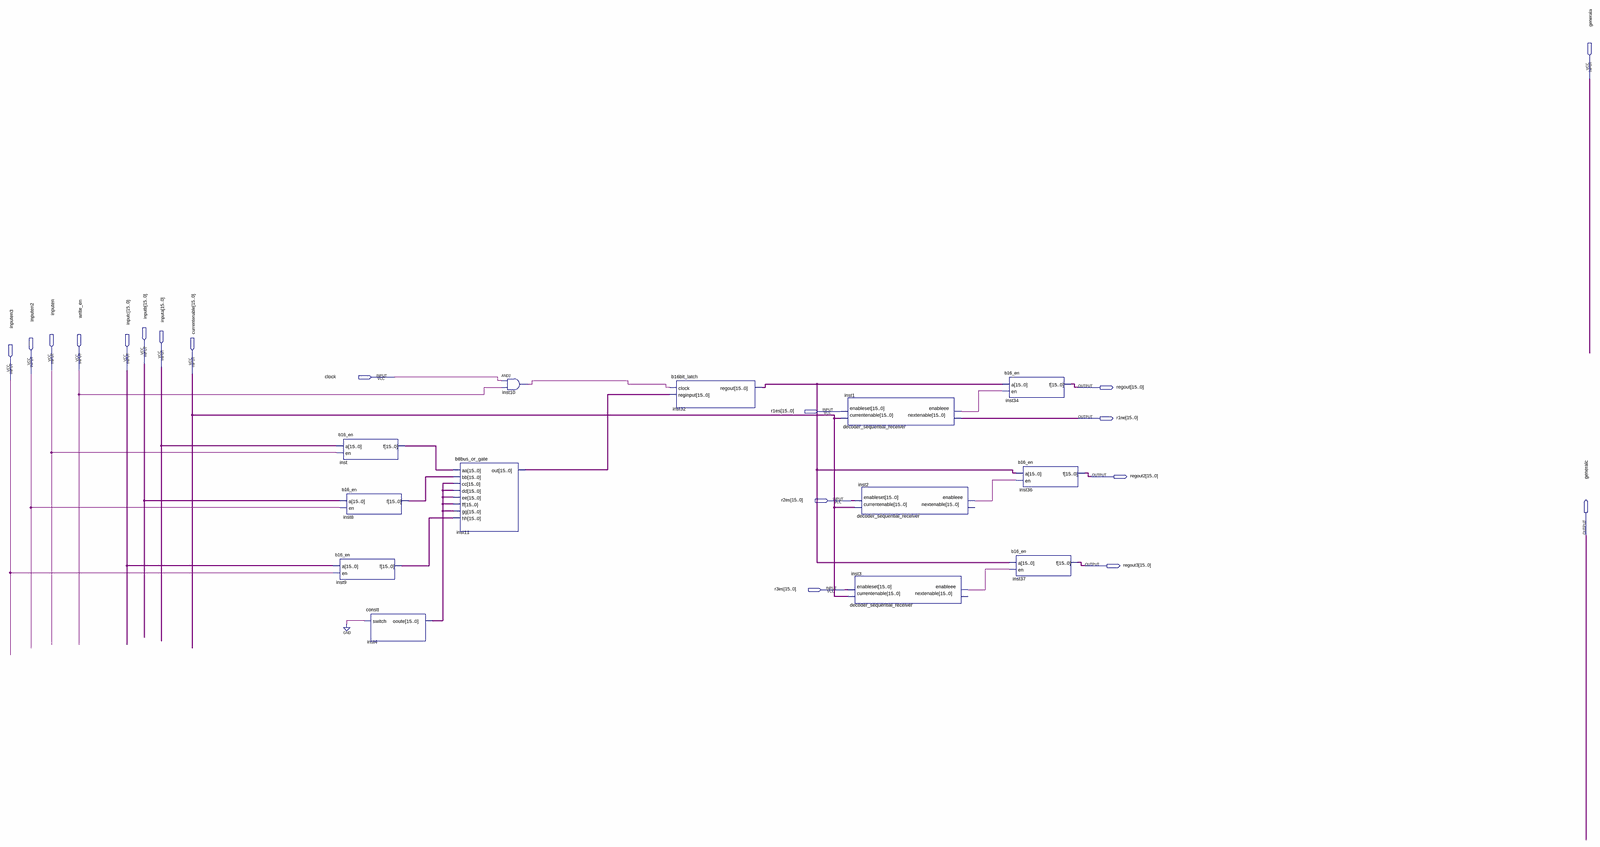
[diagram p0: schematic sheet, whole]
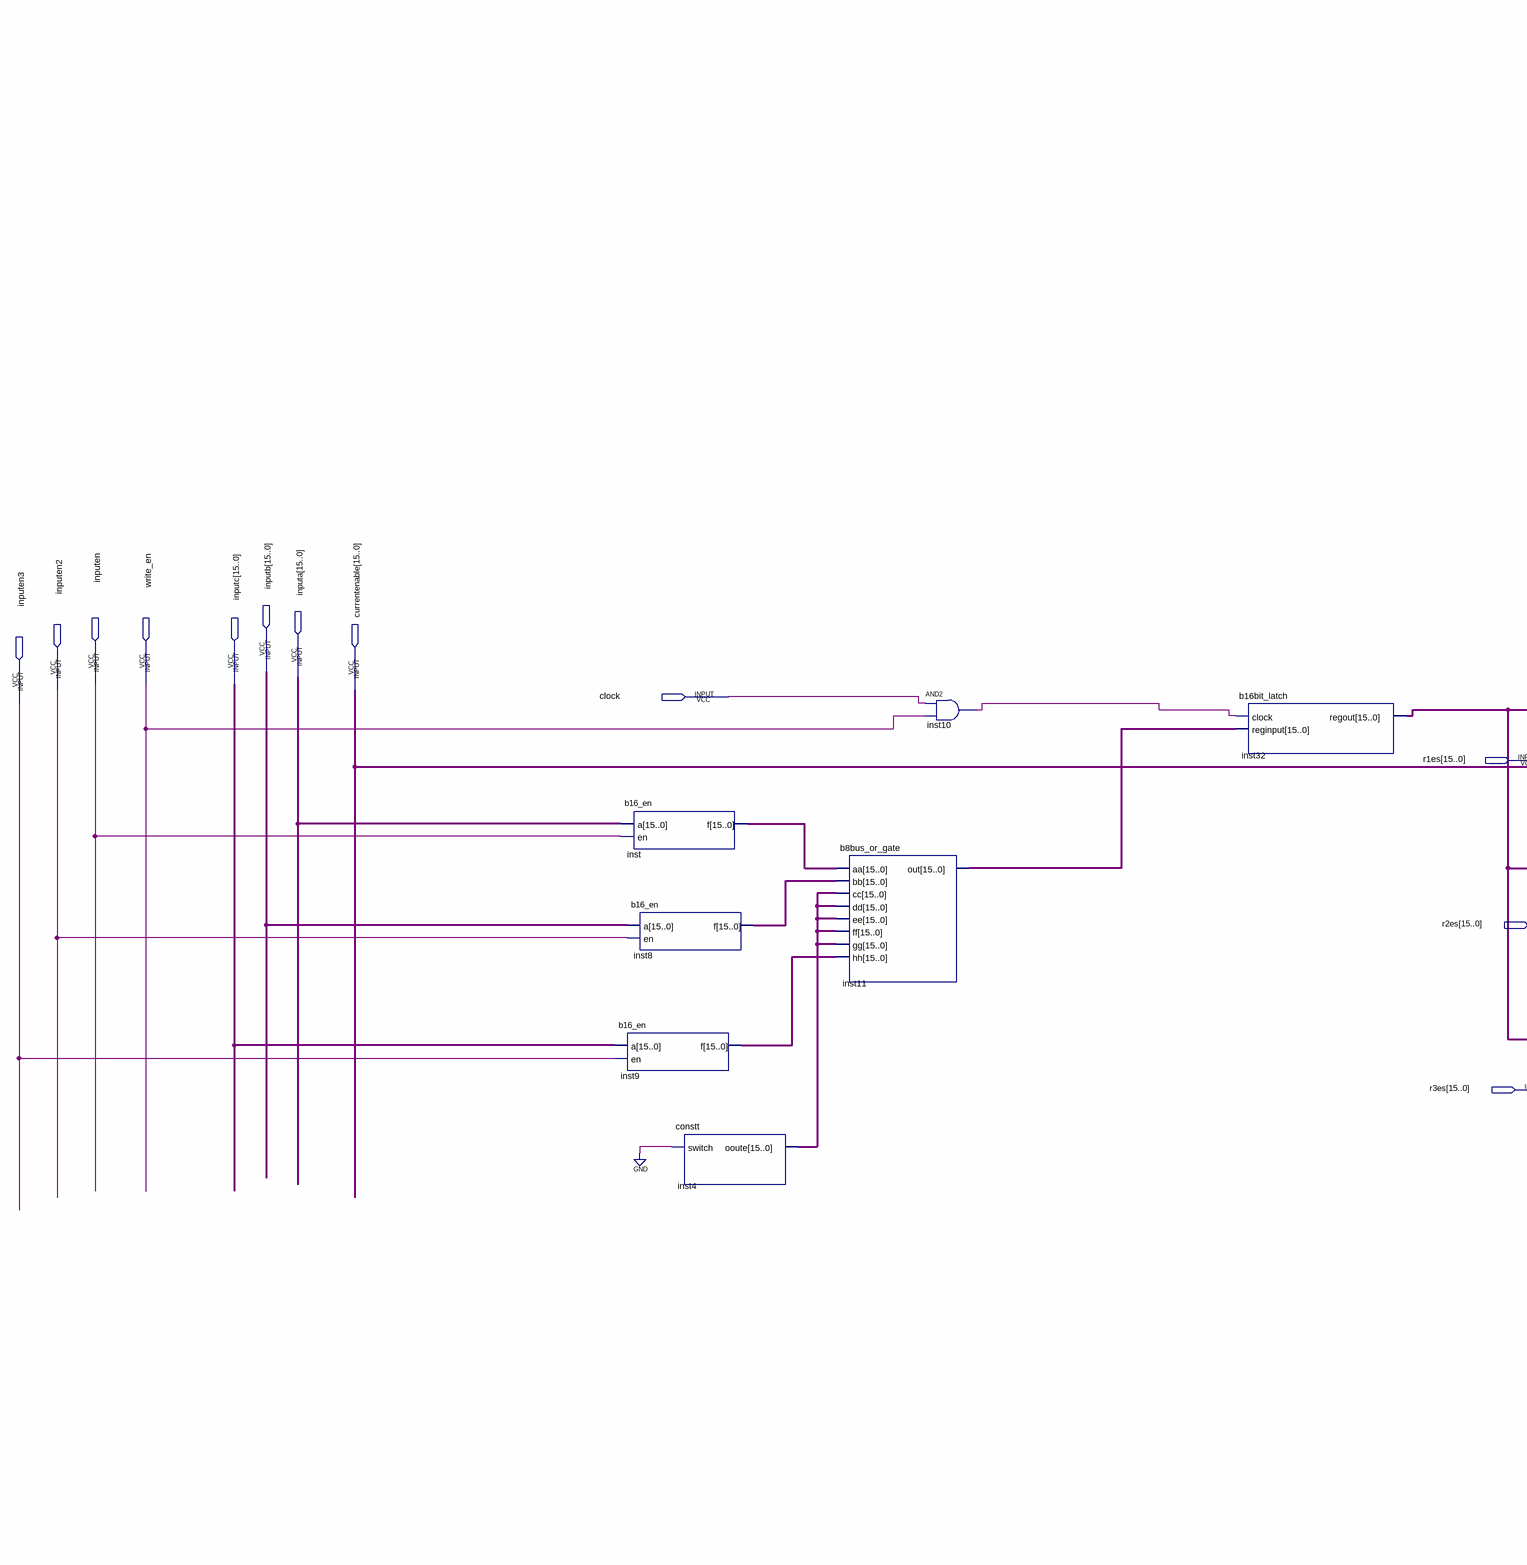
[diagram p1: schematic sheet, left part]
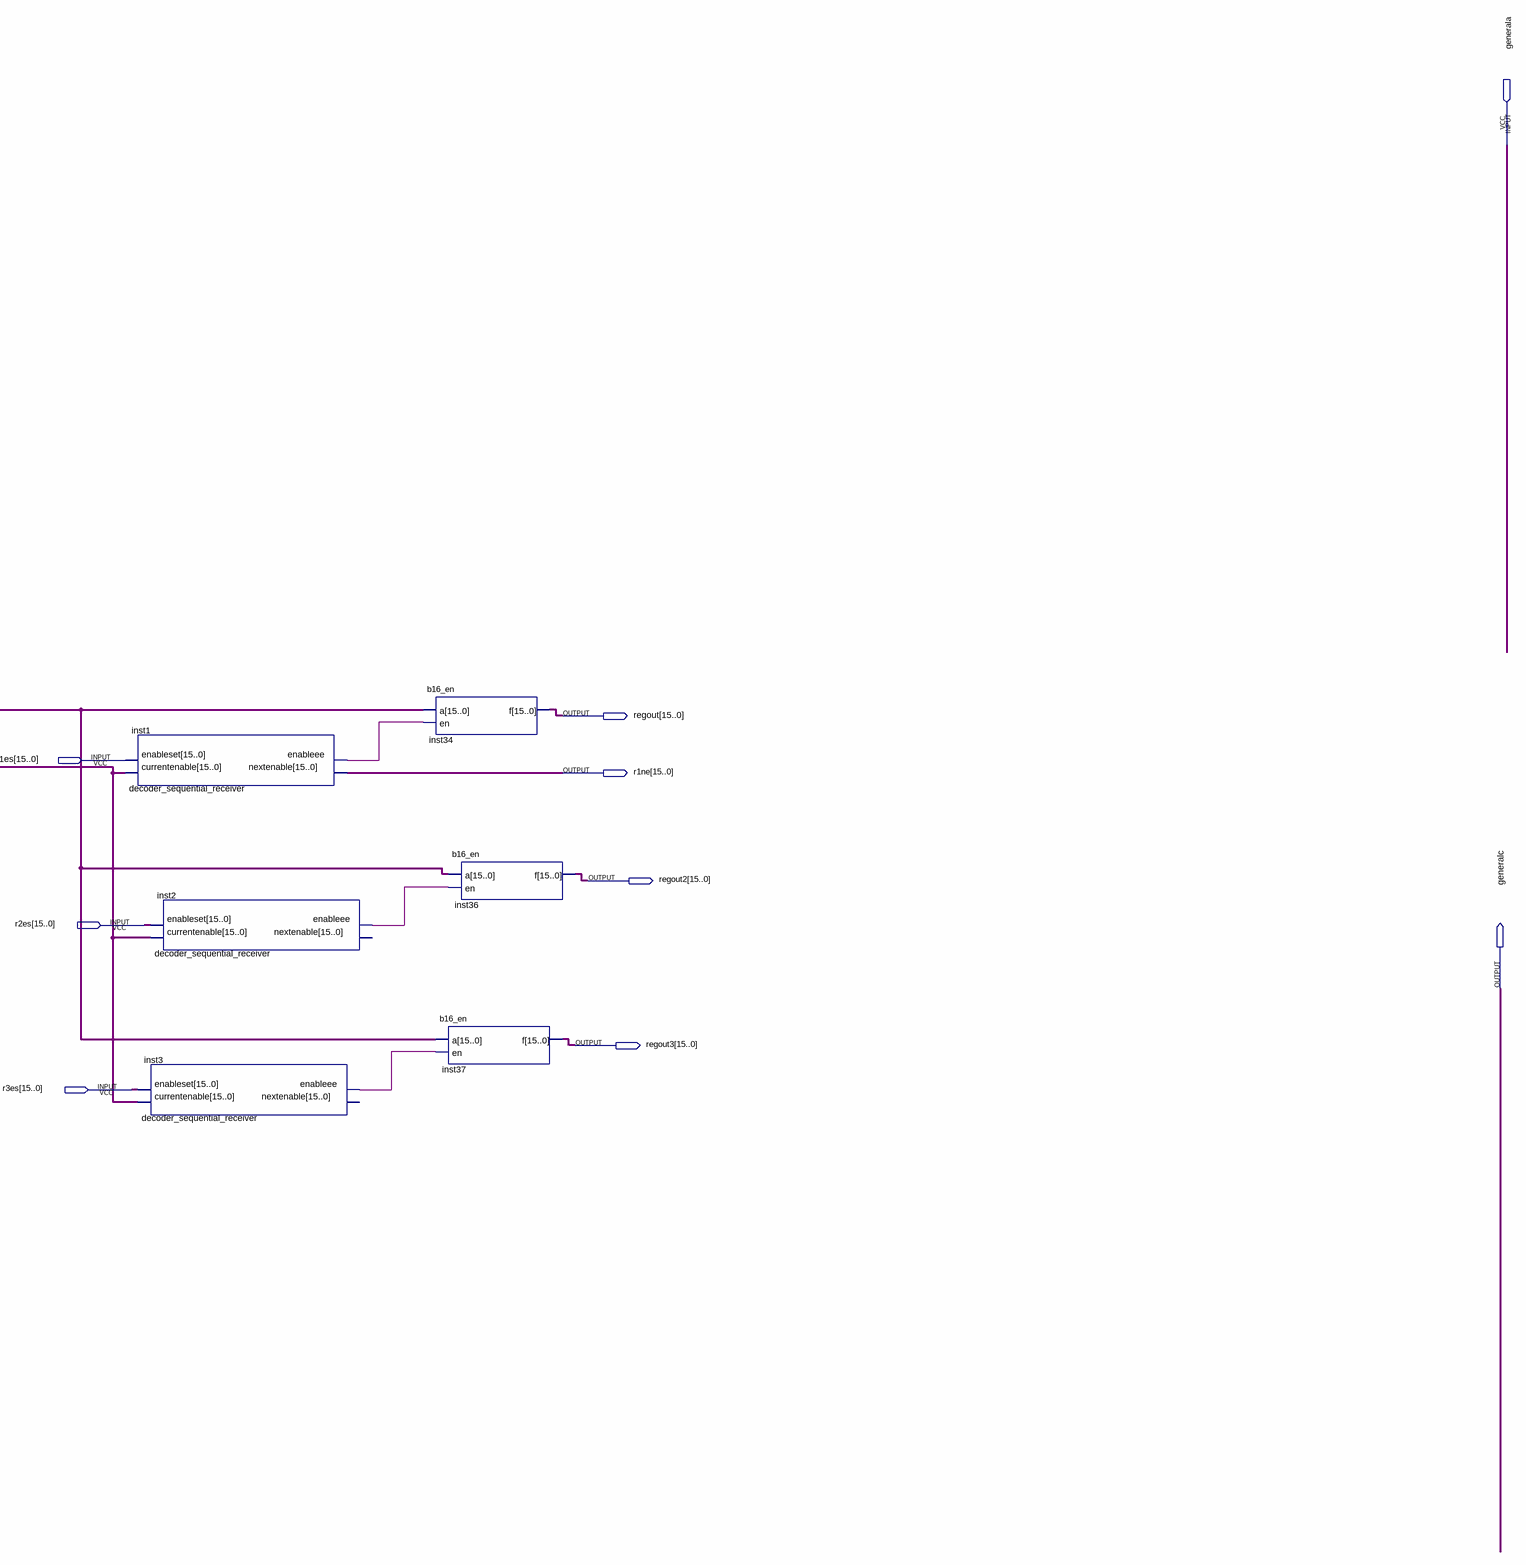
[diagram p2: schematic sheet, right part]
// Quartus schematic b16_ind_reg.bdf as structural Verilog: 13 symbols, 18 pins
module b16_ind_reg (
  input  generala,
  input  [15:0] inputb,
  input  [15:0] inputa,
  input  inputen,
  input  write_en,
  input  [15:0] inputc,
  input  inputen2,
  input  [15:0] currentenable,
  input  clock,
  input  inputen3,
  input  [15:0] r1es,
  input  [15:0] r2es,
  input  [15:0] r3es,
  output [15:0] regout,
  output [15:0] r1ne,
  output [15:0] regout2,
  output generalc,
  output [15:0] regout3
);

  wire inst1_enableee, inst2_enableee, inst3_enableee, inst10_out;
  wire [15:0] inst4_ooute, inst8_f, inst9_f, inst11_out, inst32_regout, inst_f;

  b16_en inst (.a(inputa), .en(inputen), .f(inst_f));
  b16_en inst8 (.a(inputb), .en(inputen2), .f(inst8_f));
  b16_en inst9 (.a(inputc), .en(inputen3), .f(inst9_f));
  constt inst4 (.switch(1'b0), .ooute(inst4_ooute));
  b8bus_or_gate inst11 (
    .aa(inst_f), .bb(inst8_f), .cc(inst4_ooute), .dd(inst4_ooute), .ee(inst4_ooute), .ff(inst4_ooute),
    .gg(inst4_ooute), .hh(inst9_f), .out(inst11_out));
  and inst10 (inst10_out, clock, write_en);
  b16bit_latch inst32 (.clock(inst10_out), .reginput(inst11_out), .regout(inst32_regout));
  decoder_sequential_receiver inst1 (
    .currentenable(currentenable), .enableset(r1es), .nextenable(r1ne), .enableee(inst1_enableee));
  decoder_sequential_receiver inst2 (
    .currentenable(currentenable), .enableset(r2es), .enableee(inst2_enableee));  // open: nextenable
  decoder_sequential_receiver inst3 (
    .currentenable(currentenable), .enableset(r3es), .enableee(inst3_enableee));  // open: nextenable
  b16_en inst34 (.a(inst32_regout), .en(inst1_enableee), .f(regout));
  b16_en inst37 (.a(inst32_regout), .en(inst3_enableee), .f(regout3));
  b16_en inst36 (.a(inst32_regout), .en(inst2_enableee), .f(regout2));
endmodule
